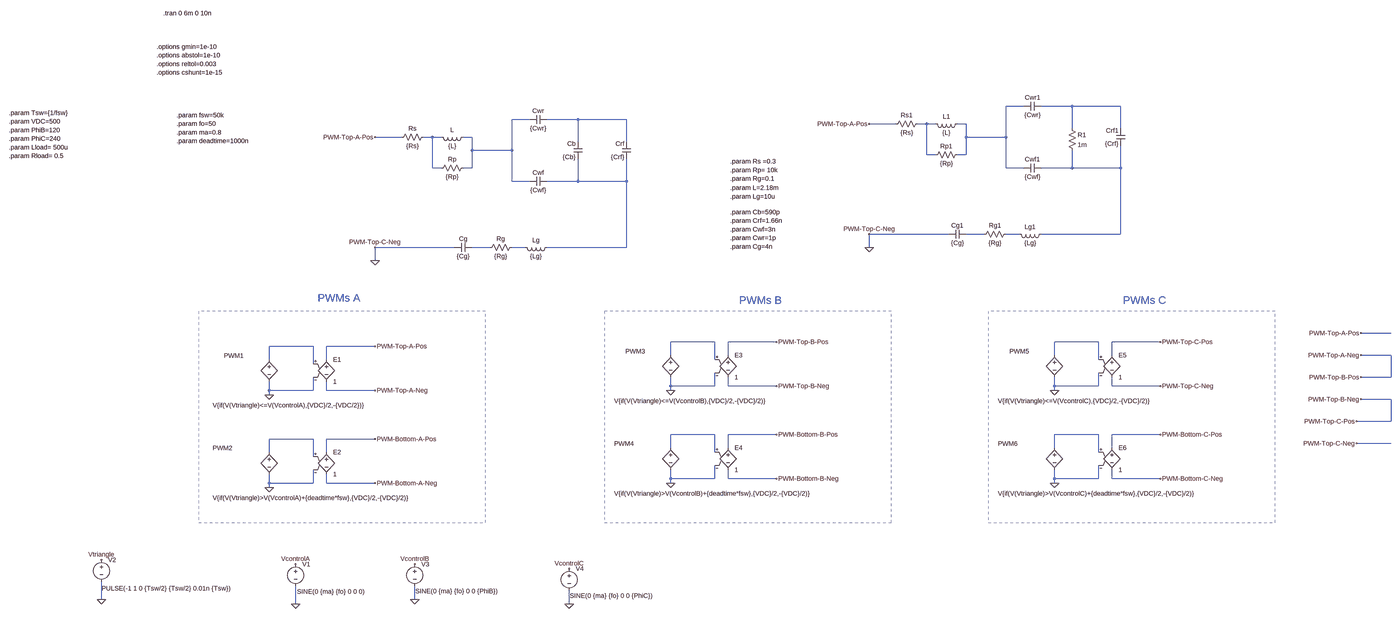
[diagram p0: schematic BearingCurrentModel.asc, whole sheet]
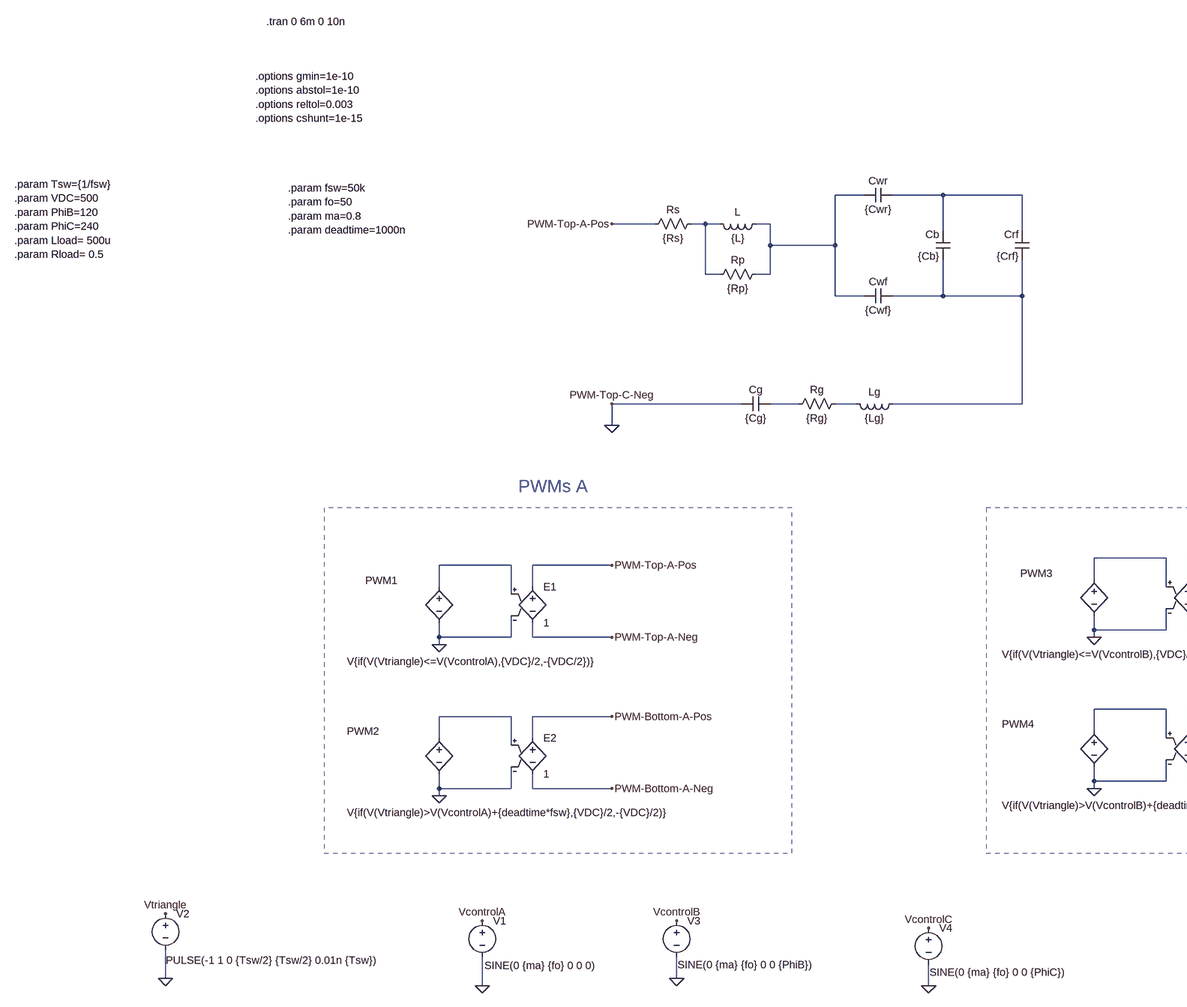
[diagram p1: schematic BearingCurrentModel.asc, part, row 1 of 1, column 1 of 2]
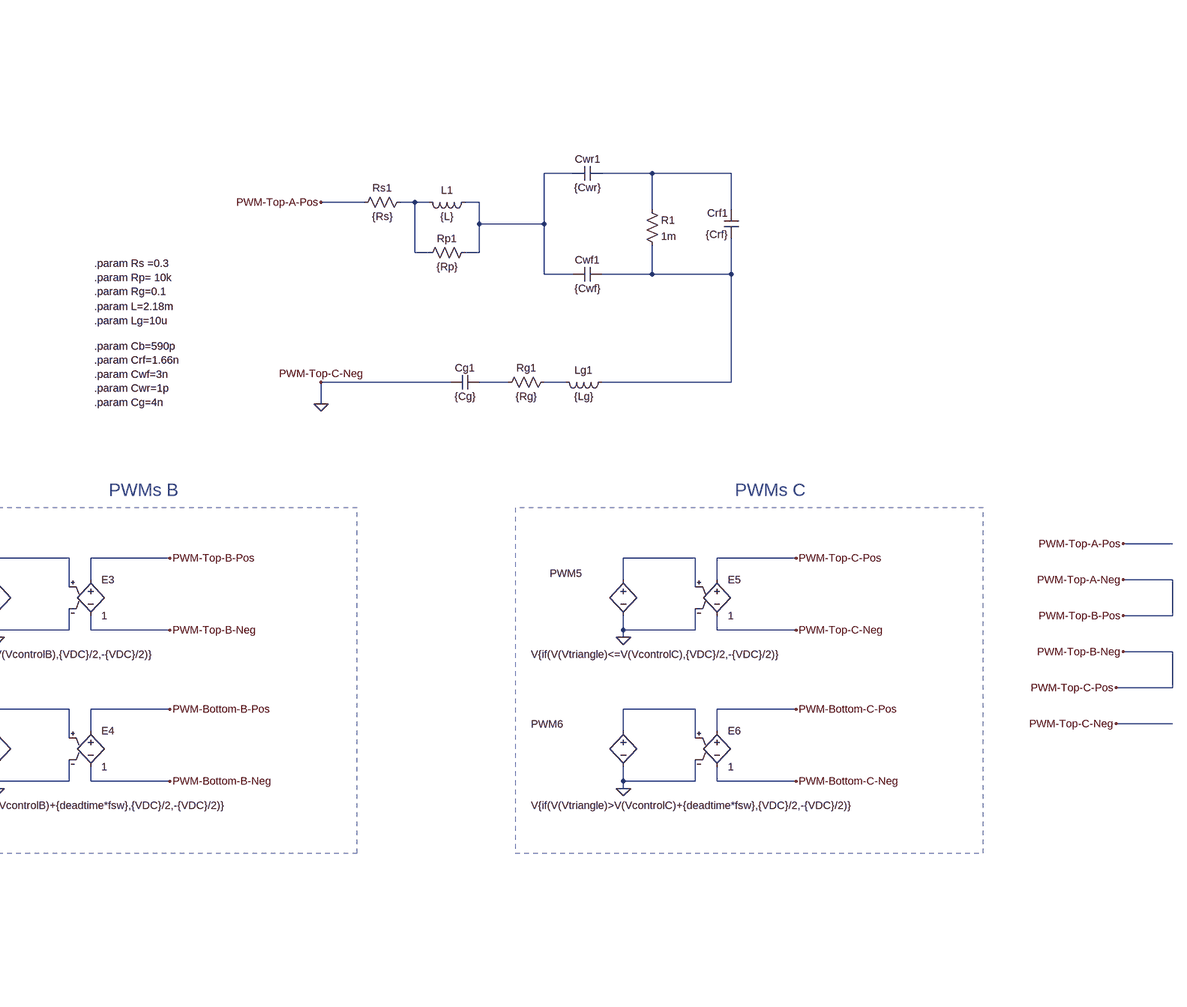
[diagram p2: schematic BearingCurrentModel.asc, part, row 1 of 1, column 2 of 2]
BearingCurrentModel.asc, the LTspice schematic file:
Version 4
SHEET 1 4356 2612
WIRE 2160 80 2096 80
WIRE 2336 80 2224 80
WIRE 2512 80 2336 80
WIRE 368 128 304 128
WIRE 544 128 432 128
WIRE 720 128 544 128
WIRE 1696 144 1600 144
WIRE 1808 144 1776 144
WIRE 1840 144 1808 144
WIRE 1952 144 1920 144
WIRE 2336 160 2336 80
WIRE 2512 160 2512 80
WIRE -96 192 -192 192
WIRE 16 192 -16 192
WIRE 48 192 16 192
WIRE 160 192 128 192
WIRE 1952 192 1952 144
WIRE 2096 192 2096 80
WIRE 2096 192 1952 192
WIRE 544 208 544 128
WIRE 720 208 720 128
WIRE 160 240 160 192
WIRE 304 240 304 128
WIRE 304 240 160 240
WIRE 1808 256 1808 144
WIRE 1840 256 1808 256
WIRE 1952 256 1952 192
WIRE 1952 256 1920 256
WIRE 16 304 16 192
WIRE 48 304 16 304
WIRE 160 304 160 240
WIRE 160 304 128 304
WIRE 2096 304 2096 192
WIRE 2160 304 2096 304
WIRE 2336 304 2336 240
WIRE 2336 304 2224 304
WIRE 2512 304 2512 224
WIRE 2512 304 2336 304
WIRE 304 352 304 240
WIRE 368 352 304 352
WIRE 544 352 544 272
WIRE 544 352 432 352
WIRE 720 352 720 272
WIRE 720 352 544 352
WIRE 1888 544 1600 544
WIRE 2016 544 1952 544
WIRE 2144 544 2096 544
WIRE 2512 544 2512 304
WIRE 2512 544 2224 544
WIRE 96 592 -192 592
WIRE 224 592 160 592
WIRE 352 592 304 592
WIRE 720 592 720 352
WIRE 720 592 432 592
WIRE 1600 592 1600 544
WIRE -192 640 -192 592
WIRE 3776 1408 3568 1408
WIRE 1040 1440 880 1440
WIRE 1264 1440 1088 1440
WIRE 2432 1440 2272 1440
WIRE 2656 1440 2480 1440
WIRE -416 1456 -576 1456
WIRE -192 1456 -368 1456
WIRE 880 1488 880 1440
WIRE 1088 1488 1088 1440
WIRE 2272 1488 2272 1440
WIRE 2480 1488 2480 1440
WIRE 3776 1488 3568 1488
WIRE -576 1504 -576 1456
WIRE -368 1504 -368 1456
WIRE 1040 1504 1040 1440
WIRE 2432 1504 2432 1440
WIRE -416 1520 -416 1456
WIRE 3776 1568 3776 1488
WIRE 3776 1568 3568 1568
WIRE 880 1600 880 1568
WIRE 1040 1600 1040 1552
WIRE 1040 1600 880 1600
WIRE 1088 1600 1088 1568
WIRE 1264 1600 1088 1600
WIRE 2272 1600 2272 1568
WIRE 2432 1600 2432 1552
WIRE 2432 1600 2272 1600
WIRE 2480 1600 2480 1568
WIRE 2656 1600 2480 1600
WIRE -576 1616 -576 1584
WIRE -416 1616 -416 1568
WIRE -416 1616 -576 1616
WIRE -368 1616 -368 1584
WIRE -192 1616 -368 1616
WIRE 880 1616 880 1600
WIRE 2272 1616 2272 1600
WIRE -576 1632 -576 1616
WIRE 3776 1648 3568 1648
WIRE 3776 1728 3776 1648
WIRE 3776 1728 3552 1728
WIRE 1040 1776 880 1776
WIRE 1264 1776 1088 1776
WIRE 2432 1776 2272 1776
WIRE 2656 1776 2480 1776
WIRE -416 1792 -576 1792
WIRE -192 1792 -368 1792
WIRE 3776 1808 3552 1808
WIRE 880 1824 880 1776
WIRE 1088 1824 1088 1776
WIRE 2272 1824 2272 1776
WIRE 2480 1824 2480 1776
WIRE -576 1840 -576 1792
WIRE -368 1840 -368 1792
WIRE 1040 1840 1040 1776
WIRE 2432 1840 2432 1776
WIRE -416 1856 -416 1792
WIRE 880 1936 880 1904
WIRE 1040 1936 1040 1888
WIRE 1040 1936 880 1936
WIRE 1088 1936 1088 1904
WIRE 1264 1936 1088 1936
WIRE 2272 1936 2272 1904
WIRE 2432 1936 2432 1888
WIRE 2432 1936 2272 1936
WIRE 2480 1936 2480 1904
WIRE 2656 1936 2480 1936
WIRE -576 1952 -576 1920
WIRE -416 1952 -416 1904
WIRE -416 1952 -576 1952
WIRE -368 1952 -368 1920
WIRE -192 1952 -368 1952
WIRE 880 1952 880 1936
WIRE 2272 1952 2272 1936
WIRE -576 1968 -576 1952
WIRE -1184 2576 -1184 2512
WIRE -48 2576 -48 2528
WIRE -480 2592 -480 2528
WIRE 512 2592 512 2544
FLAG -192 640 0
FLAG 1600 592 0
FLAG -1184 2576 0
FLAG -480 2592 0
FLAG -1184 2432 Vtriangle
FLAG -480 2448 VcontrolA
FLAG -48 2576 0
FLAG -48 2448 VcontrolB
FLAG -576 1632 0
FLAG -576 1968 0
FLAG 880 1616 0
FLAG 880 1952 0
FLAG -192 1456 PWM-Top-A-Pos
FLAG -192 1616 PWM-Top-A-Neg
FLAG -192 1792 PWM-Bottom-A-Pos
FLAG -192 1952 PWM-Bottom-A-Neg
FLAG 1264 1440 PWM-Top-B-Pos
FLAG 1264 1600 PWM-Top-B-Neg
FLAG 1264 1776 PWM-Bottom-B-Pos
FLAG 1264 1936 PWM-Bottom-B-Neg
FLAG 512 2592 0
FLAG 512 2464 VcontrolC
FLAG 2272 1616 0
FLAG 2272 1952 0
FLAG 2656 1440 PWM-Top-C-Pos
FLAG 2656 1600 PWM-Top-C-Neg
FLAG 2656 1776 PWM-Bottom-C-Pos
FLAG 2656 1936 PWM-Bottom-C-Neg
FLAG -192 192 PWM-Top-A-Pos
FLAG 3568 1408 PWM-Top-A-Pos
FLAG 3568 1488 PWM-Top-A-Neg
FLAG 3568 1568 PWM-Top-B-Pos
FLAG 3568 1648 PWM-Top-B-Neg
FLAG 3552 1728 PWM-Top-C-Pos
FLAG 3552 1808 PWM-Top-C-Neg
FLAG 1600 144 PWM-Top-A-Pos
FLAG 1600 544 PWM-Top-C-Neg
FLAG -192 592 PWM-Top-C-Neg
SYMBOL res 0 176 R90
WINDOW 0 0 56 VBottom 2
WINDOW 3 32 56 VTop 2
SYMATTR InstName Rs
SYMATTR Value {Rs}
SYMBOL ind 144 176 R90
WINDOW 0 5 56 VBottom 2
WINDOW 3 32 56 VTop 2
SYMATTR InstName L
SYMATTR Value {L}
SYMBOL res 144 288 R90
WINDOW 0 0 56 VBottom 2
WINDOW 3 32 56 VTop 2
SYMATTR InstName Rp
SYMATTR Value {Rp}
SYMBOL cap 160 576 R90
WINDOW 0 0 32 VBottom 2
WINDOW 3 32 32 VTop 2
SYMATTR InstName Cg
SYMATTR Value {Cg}
SYMBOL res 320 576 R90
WINDOW 0 0 56 VBottom 2
WINDOW 3 32 56 VTop 2
SYMATTR InstName Rg
SYMATTR Value {Rg}
SYMBOL ind 448 576 R90
WINDOW 0 5 56 VBottom 2
WINDOW 3 32 56 VTop 2
SYMATTR InstName Lg
SYMATTR Value {Lg}
SYMBOL cap 432 112 R90
WINDOW 0 0 32 VBottom 2
WINDOW 3 32 32 VTop 2
SYMATTR InstName Cwr
SYMATTR Value {Cwr}
SYMBOL cap 432 336 R90
WINDOW 0 0 32 VBottom 2
WINDOW 3 32 32 VTop 2
SYMATTR InstName Cwf
SYMATTR Value {Cwf}
SYMBOL cap 560 272 R180
WINDOW 0 24 56 Left 2
WINDOW 3 24 8 Left 2
SYMATTR InstName Cb
SYMATTR Value {Cb}
SYMBOL cap 736 272 R180
WINDOW 0 24 56 Left 2
WINDOW 3 24 8 Left 2
SYMATTR InstName Crf
SYMATTR Value {Crf}
SYMBOL res 1792 128 R90
WINDOW 0 0 56 VBottom 2
WINDOW 3 32 56 VTop 2
SYMATTR InstName Rs1
SYMATTR Value {Rs}
SYMBOL ind 1936 128 R90
WINDOW 0 5 56 VBottom 2
WINDOW 3 32 56 VTop 2
SYMATTR InstName L1
SYMATTR Value {L}
SYMBOL res 1936 240 R90
WINDOW 0 0 56 VBottom 2
WINDOW 3 32 56 VTop 2
SYMATTR InstName Rp1
SYMATTR Value {Rp}
SYMBOL cap 1952 528 R90
WINDOW 0 0 32 VBottom 2
WINDOW 3 32 32 VTop 2
SYMATTR InstName Cg1
SYMATTR Value {Cg}
SYMBOL res 2112 528 R90
WINDOW 0 0 56 VBottom 2
WINDOW 3 32 56 VTop 2
SYMATTR InstName Rg1
SYMATTR Value {Rg}
SYMBOL ind 2240 528 R90
WINDOW 0 5 56 VBottom 2
WINDOW 3 32 56 VTop 2
SYMATTR InstName Lg1
SYMATTR Value {Lg}
SYMBOL cap 2224 64 R90
WINDOW 0 0 32 VBottom 2
WINDOW 3 32 32 VTop 2
SYMATTR InstName Cwr1
SYMATTR Value {Cwr}
SYMBOL cap 2224 288 R90
WINDOW 0 0 32 VBottom 2
WINDOW 3 32 32 VTop 2
SYMATTR InstName Cwf1
SYMATTR Value {Cwf}
SYMBOL cap 2528 224 R180
WINDOW 0 24 56 Left 2
WINDOW 3 24 8 Left 2
SYMATTR InstName Crf1
SYMATTR Value {Crf}
SYMBOL res 2320 144 R0
SYMATTR InstName R1
SYMATTR Value 1m
SYMBOL voltage -480 2432 R0
WINDOW 123 0 0 Left 0
WINDOW 39 0 0 Left 0
WINDOW 3 5 115 Left 2
SYMATTR Value SINE(0 {ma} {fo} 0 0 0)
SYMATTR InstName V1
SYMBOL voltage -1184 2416 R0
WINDOW 123 0 0 Left 0
WINDOW 39 0 0 Left 0
WINDOW 3 1 120 Left 2
SYMATTR Value PULSE(-1 1 0 {Tsw/2} {Tsw/2} 0.01n {Tsw})
SYMATTR InstName V2
SYMBOL voltage -48 2432 R0
WINDOW 123 0 0 Left 0
WINDOW 39 0 0 Left 0
WINDOW 3 2 114 Left 2
SYMATTR Value SINE(0 {ma} {fo} 0 0 {PhiB})
SYMATTR InstName V3
SYMBOL bv -576 1488 R0
WINDOW 0 -164 2 Left 2
WINDOW 3 -205 182 Left 2
SYMATTR InstName PWM1
SYMATTR Value V{if(V(Vtriangle)<=V(VcontrolA),{VDC}/2,-{VDC/2})}
SYMBOL e -368 1488 R0
SYMATTR InstName E1
SYMATTR Value 1
SYMBOL bv -576 1824 R0
WINDOW 0 -205 1 Left 2
WINDOW 3 -205 182 Left 2
SYMATTR InstName PWM2
SYMATTR Value V{if(V(Vtriangle)>V(VcontrolA)+{deadtime*fsw},{VDC}/2,-{VDC}/2)}
SYMBOL e -368 1824 R0
SYMATTR InstName E2
SYMATTR Value 1
SYMBOL bv 880 1472 R0
WINDOW 0 -164 2 Left 2
WINDOW 3 -205 182 Left 2
SYMATTR InstName PWM3
SYMATTR Value V{if(V(Vtriangle)<=V(VcontrolB),{VDC}/2,-{VDC}/2)}
SYMBOL e 1088 1472 R0
SYMATTR InstName E3
SYMATTR Value 1
SYMBOL bv 880 1808 R0
WINDOW 0 -205 1 Left 2
WINDOW 3 -205 182 Left 2
SYMATTR InstName PWM4
SYMATTR Value V{if(V(Vtriangle)>V(VcontrolB)+{deadtime*fsw},{VDC}/2,-{VDC}/2)}
SYMBOL e 1088 1808 R0
SYMATTR InstName E4
SYMATTR Value 1
SYMBOL voltage 512 2448 R0
WINDOW 123 0 0 Left 0
WINDOW 39 0 0 Left 0
WINDOW 3 2 114 Left 2
SYMATTR Value SINE(0 {ma} {fo} 0 0 {PhiC})
SYMATTR InstName V4
SYMBOL bv 2272 1472 R0
WINDOW 0 -164 2 Left 2
WINDOW 3 -205 182 Left 2
SYMATTR InstName PWM5
SYMATTR Value V{if(V(Vtriangle)<=V(VcontrolC),{VDC}/2,-{VDC}/2)}
SYMBOL e 2480 1472 R0
SYMATTR InstName E5
SYMATTR Value 1
SYMBOL bv 2272 1808 R0
WINDOW 0 -205 1 Left 2
WINDOW 3 -205 182 Left 2
SYMATTR InstName PWM6
SYMATTR Value V{if(V(Vtriangle)>V(VcontrolC)+{deadtime*fsw},{VDC}/2,-{VDC}/2)}
SYMBOL e 2480 1808 R0
SYMATTR InstName E6
SYMATTR Value 1
TEXT 1096 280 Left 2 !.param Rs =0.3\n.param Rp= 10k\n.param Rg=0.1
TEXT 1096 376 Left 2 !.param L=2.18m\n.param Lg=10u
TEXT 1096 464 Left 2 !.param Cb=590p\n.param Crf=1.66n\n.param Cwf=3n\n.param Cwr=1p\n.param Cg=4n
TEXT -400 1280 Left 4 ;PWMs A
TEXT 1128 1288 Left 4 ;PWMs B
TEXT 2520 1288 Left 4 ;PWMs C
TEXT -960 -368 Left 2 !.tran 0 6m 0 10n
TEXT -984 -136 Left 2 !.options gmin=1e-10   \n.options abstol=1e-10  \n.options reltol=0.003  \n.options cshunt=1e-15
TEXT -912 112 Left 2 !.param fsw=50k\n.param fo=50\n.param ma=0.8\n.param deadtime=1000n
TEXT -1520 104 Left 2 !.param Tsw={1/fsw}\n.param VDC=500\n.param PhiB=120\n.param PhiC=240\n.param Lload= 500u\n.param Rload= 0.5
RECTANGLE Normal -832 2096 208 1328 1
RECTANGLE Normal 640 2096 1680 1328 1
RECTANGLE Normal 2032 2096 3072 1328 1

The netlist it stands for:
* BearingCurrentModel.asc
Rs N006 PWM-Top-A-Pos {Rs}
L N003 N006 {L}
Rp N003 N006 {Rp}
Cg N011 0 {Cg}
Rg N012 N011 {Rg}
Lg N008 N012 {Lg}
Cwr N004 N003 {Cwr}
Cwf N008 N003 {Cwf}
Cb N008 N004 {Cb}
Crf N008 N004 {Crf}
Rs1 N005 PWM-Top-A-Pos {Rs}
L1 N001 N005 {L}
Rp1 N001 N005 {Rp}
Cg1 N009 0 {Cg}
Rg1 N010 N009 {Rg}
Lg1 N007 N010 {Lg}
Cwr1 N002 N001 {Cwr}
Cwf1 N007 N001 {Cwf}
Crf1 N007 N002 {Crf}
R1 N002 N007 1m
V1 VcontrolA 0 SINE(0 {ma} {fo} 0 0 0)
V2 Vtriangle 0 PULSE(-1 1 0 {Tsw/2} {Tsw/2} 0.01n {Tsw})
V3 VcontrolB 0 SINE(0 {ma} {fo} 0 0 {PhiB})
B§PWM1 N015 0 V{if(V(Vtriangle)<=V(VcontrolA),{VDC}/2,-{VDC/2})}
E1 PWM-Top-A-Pos PWM-Top-B-Pos N015 0 1
B§PWM2 N018 0 V{if(V(Vtriangle)>V(VcontrolA)+{deadtime*fsw},{VDC}/2,-{VDC}/2)}
E2 PWM-Bottom-A-Pos PWM-Bottom-A-Neg N018 0 1
B§PWM3 N013 0 V{if(V(Vtriangle)<=V(VcontrolB),{VDC}/2,-{VDC}/2)}
E3 PWM-Top-B-Pos PWM-Top-C-Pos N013 0 1
B§PWM4 N016 0 V{if(V(Vtriangle)>V(VcontrolB)+{deadtime*fsw},{VDC}/2,-{VDC}/2)}
E4 PWM-Bottom-B-Pos PWM-Bottom-B-Neg N016 0 1
V4 VcontrolC 0 SINE(0 {ma} {fo} 0 0 {PhiC})
B§PWM5 N014 0 V{if(V(Vtriangle)<=V(VcontrolC),{VDC}/2,-{VDC}/2)}
E5 PWM-Top-C-Pos 0 N014 0 1
B§PWM6 N017 0 V{if(V(Vtriangle)>V(VcontrolC)+{deadtime*fsw},{VDC}/2,-{VDC}/2)}
E6 PWM-Bottom-C-Pos PWM-Bottom-C-Neg N017 0 1
.param Rs =0.3
.param Rp= 10k
.param Rg=0.1
.param L=2.18m
.param Lg=10u
.param Cb=590p
.param Crf=1.66n
.param Cwf=3n
.param Cwr=1p
.param Cg=4n
* PWMs A
* PWMs B
* PWMs C
.tran 0 6m 0 10n
.options gmin=1e-10
.options abstol=1e-10
.options reltol=0.003
.options cshunt=1e-15
.param fsw=50k
.param fo=50
.param ma=0.8
.param deadtime=1000n
.param Tsw={1/fsw}
.param VDC=500
.param PhiB=120
.param PhiC=240
.param Lload= 500u
.param Rload= 0.5
.backanno
.end